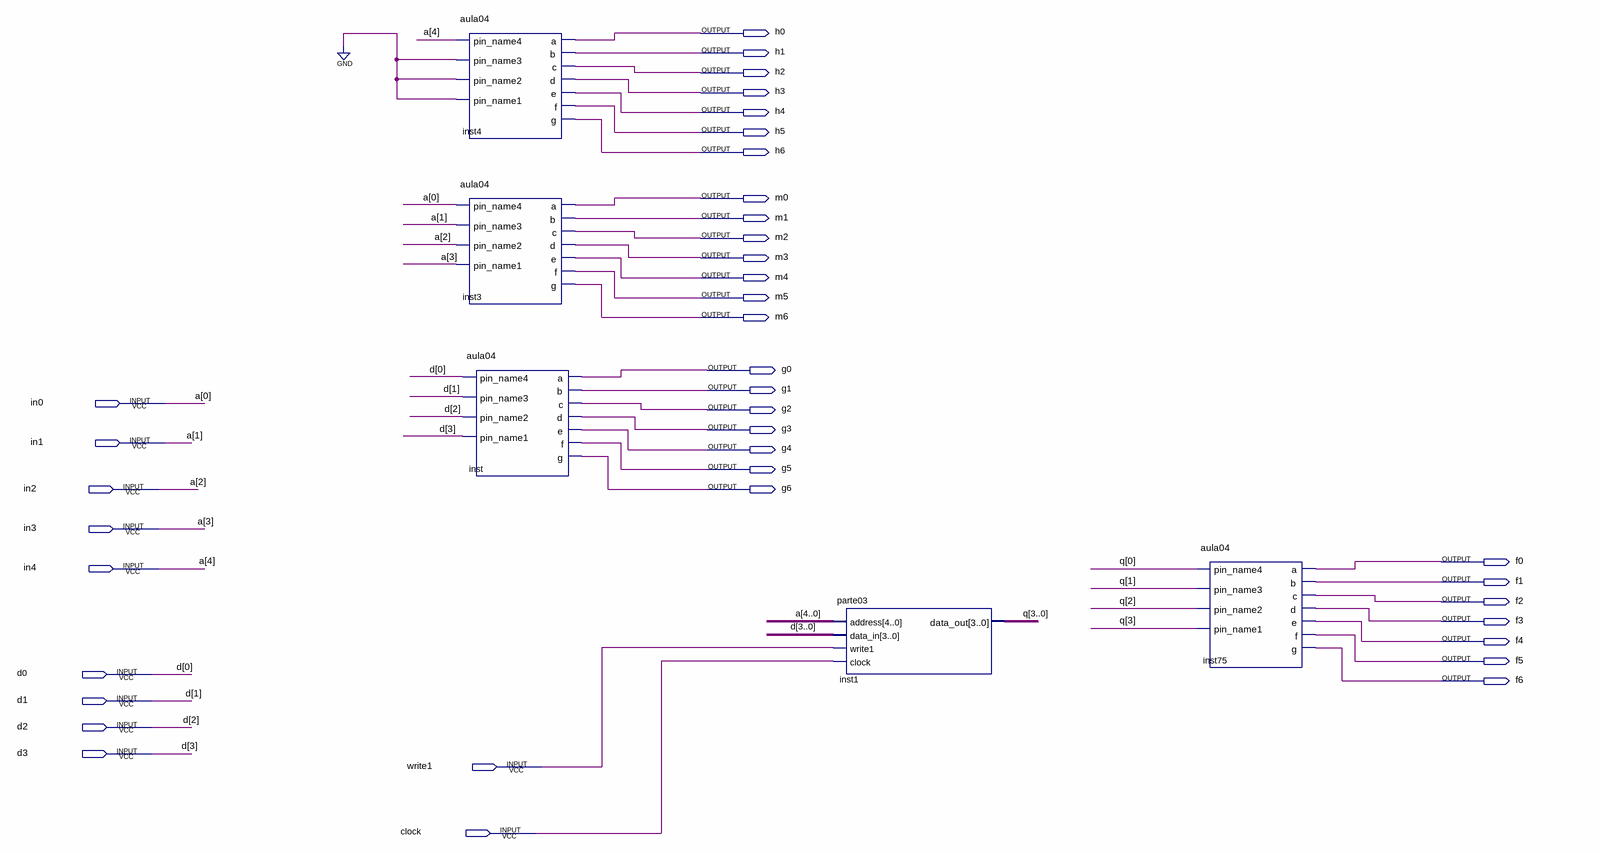
[diagram p0: schematic sheet]
// Quartus schematic memoria.bdf as structural Verilog: 5 symbols, 39 pins
module memoria (
  input  in0,
  input  in1,
  input  in2,
  input  in3,
  input  in4,
  input  d0,
  input  d1,
  input  d2,
  input  d3,
  input  write1,
  input  clock,
  output h0,
  output h1,
  output h2,
  output h3,
  output h4,
  output h5,
  output h6,
  output m0,
  output m1,
  output m2,
  output m3,
  output m4,
  output m5,
  output m6,
  output g0,
  output g1,
  output g2,
  output g3,
  output g4,
  output g5,
  output g6,
  output f0,
  output f1,
  output f2,
  output f3,
  output f4,
  output f5,
  output f6
);

  wire [3:0] q;

  aula04 inst4 (
    .pin_name1(1'b0), .pin_name4(in4), .pin_name2(1'b0), .pin_name3(1'b0), .a(h0), .b(h1), .c(h2), .d(h3),
    .e(h4), .f(h5), .g(h6));
  aula04 inst3 (
    .pin_name1(in3), .pin_name4(in0), .pin_name2(in2), .pin_name3(in1), .a(m0), .b(m1), .c(m2), .d(m3),
    .e(m4), .f(m5), .g(m6));
  aula04 inst (
    .pin_name1(d3), .pin_name4(d0), .pin_name2(d2), .pin_name3(d1), .a(g0), .b(g1), .c(g2), .d(g3), .e(g4),
    .f(g5), .g(g6));
  parte03 inst1 (
    .address({in4, in3, in2, in1, in0}), .data_in({d3, d2, d1, d0}), .write1(write1), .clock(clock),
    .data_out(q));
  aula04 inst75 (
    .pin_name1(q[3]), .pin_name4(q[0]), .pin_name2(q[2]), .pin_name3(q[1]), .a(f0), .b(f1), .c(f2), .d(f3),
    .e(f4), .f(f5), .g(f6));

  // Other names for the same wires on the sheet: a[4:0] = {in4, in3, in2, in1, in0}
endmodule
